# EAGLE schematic Desktop Widget ESP03 (EAGLE 7.3.0)
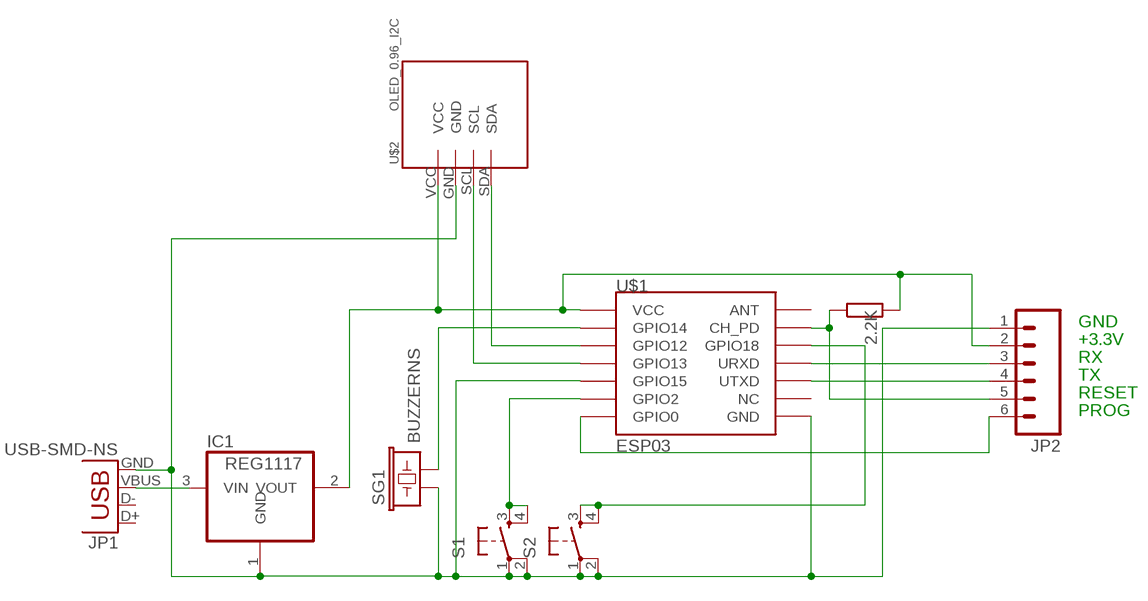
[diagram p0: schematic, sheet 1]
R1 (R): R: 2.2K

## Parts
IC1  REG1117  [SOT223]
JP1  USB-SMD-NS  [USB-MINIB-NOSTOP]
JP2  M06SILK_FEMALE_PTH  [1X06]
S1  TAC_SWITCHPTH  [TACTILE-PTH]
S2  TAC_SWITCHPTH  [TACTILE-PTH]
SG1  BUZZERNS  [BUZZER-12MM-NS]
U$1  ESP03  [ESP03]
U$2  OLED_0.96_I2C  [OLED_0.96_I2C]

## Nets
N$1: S1.3 S1.4 U$1.GPIO2
N$2: IC1.1(GND) JP1.GND JP2.1 S1.1 S1.2 S2.1 S2.2 SG1.+ U$1.GND U$1.GPIO15 U$2.GND
N$3: S2.3 S2.4 U$1.GPIO18
N$4: SG1.- U$1.GPIO14
N$5: U$1.GPIO12 U$2.SDA
N$6: IC1.2(VOUT) JP2.2 U$1.VCC U$2.VCC
N$7: U$1.GPIO13 U$2.SCL
N$8: JP1.VBUS
N$9: JP2.5 U$1.CH_PD
N$12: JP2.3 U$1.URXD
N$13: JP2.4 U$1.UTXD
N$14: JP2.6 U$1.GPIO0
Unconnected: IC1.3(VIN) JP1.D+ JP1.D- U$1.ANT U$1.NC

## Notes on the sheet
- GND
- +3.3V
- RX
- TX
- RESET
- PROG

## Library data of the parts
IC1 = burr-brown:REG1117: 800mA and 1A Low Dropout (LDO) Positive Regulator 1.8V, 2.5V, 2.85V, 3.3V, 5V, and Adj; MPN: REG1117; OC_FARNELL: 1097566; OC_NEWARK: 14P6981
JP1 = SparkFun-Connectors:USB: USB Connectors USB-B-PTH is fully proven SKU : PRT-00139/CONN-08278 USB-miniB is fully proven SKU : PRT-00587 USB-A-PCB is untested. USB-A-H is throughly reviewed, but untested. Spark Fun Electronics SKU : PRT-00437 USB-B-SMT is throughly reviewed, but untested. Needs silkscreen touching up. USB-A-S has not been used/tested USB-MB-H has not been used/tested USB-MICROB has been used. CONN-09505
JP2 = SparkFun-Connectors:M06: Header 6 Standard 6-pin 0.1" header. Use with straight break away headers (SKU : PRT-00116), right angle break away headers (PRT-00553), swiss pins (PRT-00743), machine pins (PRT-00117), and female headers (PRT-00115). Molex polarized connector foot print use with SKU : PRT-08094 with associated crimp pins and housings. NOTES ON THE VARIANTS LOCK and LOCK_LONGPADS... This footprint was designed to help hold the alignment of a through-hole component (i.e. 6-pin header) while soldering it into place. You may notice that each hole has been shifted either up or down by 0.005 of an inch from it's more standard position (which is a perfectly straight line). This slight alteration caused the pins (the squares in the middle) to touch the edges of the holes. Because they are alternating, it causes a "brace" to hold the component in place. 0.005 has proven to be the perfect amount of "off-center" position when using our standard breakaway headers. Although looks a little odd when you look at the bare footprint, once you have a header in there, the alteration is very hard to notice. Also,if you push a header all the way into place, it is covered up entirely on the bottom side. This idea of altering the position of holes to aid alignment will be further integrated into the Sparkfun Library for other footprints. It can help hold any component with 3 or more connection pins.; PROD_ID: CONN-08437
S1 S2 = SparkFun-Retired:TAC_SWITCH: Momentary Switch Button commonly used for reset or general input. Spark Fun Electronics SKU : COM-00097 SMT- SWCH-08247
SG1 = SparkFun-Electromechanical:BUZZER: Buzzer 12mm Spark Fun Electronics SKU : Comp-Buzzer
U$1 = esp8266modules:ESP03: ESP8266 Wifi module 03; DIMENSIONS: 17.3 x 12.1 mm; PINS: 14; PITCH: 0.078" / 2 mm
U$2 = tft_1.8_1.44_oled_0.96:OLED_0.96_I2C